# EAGLE schematic Placa_Principal_VF (EAGLE 9.7.0)
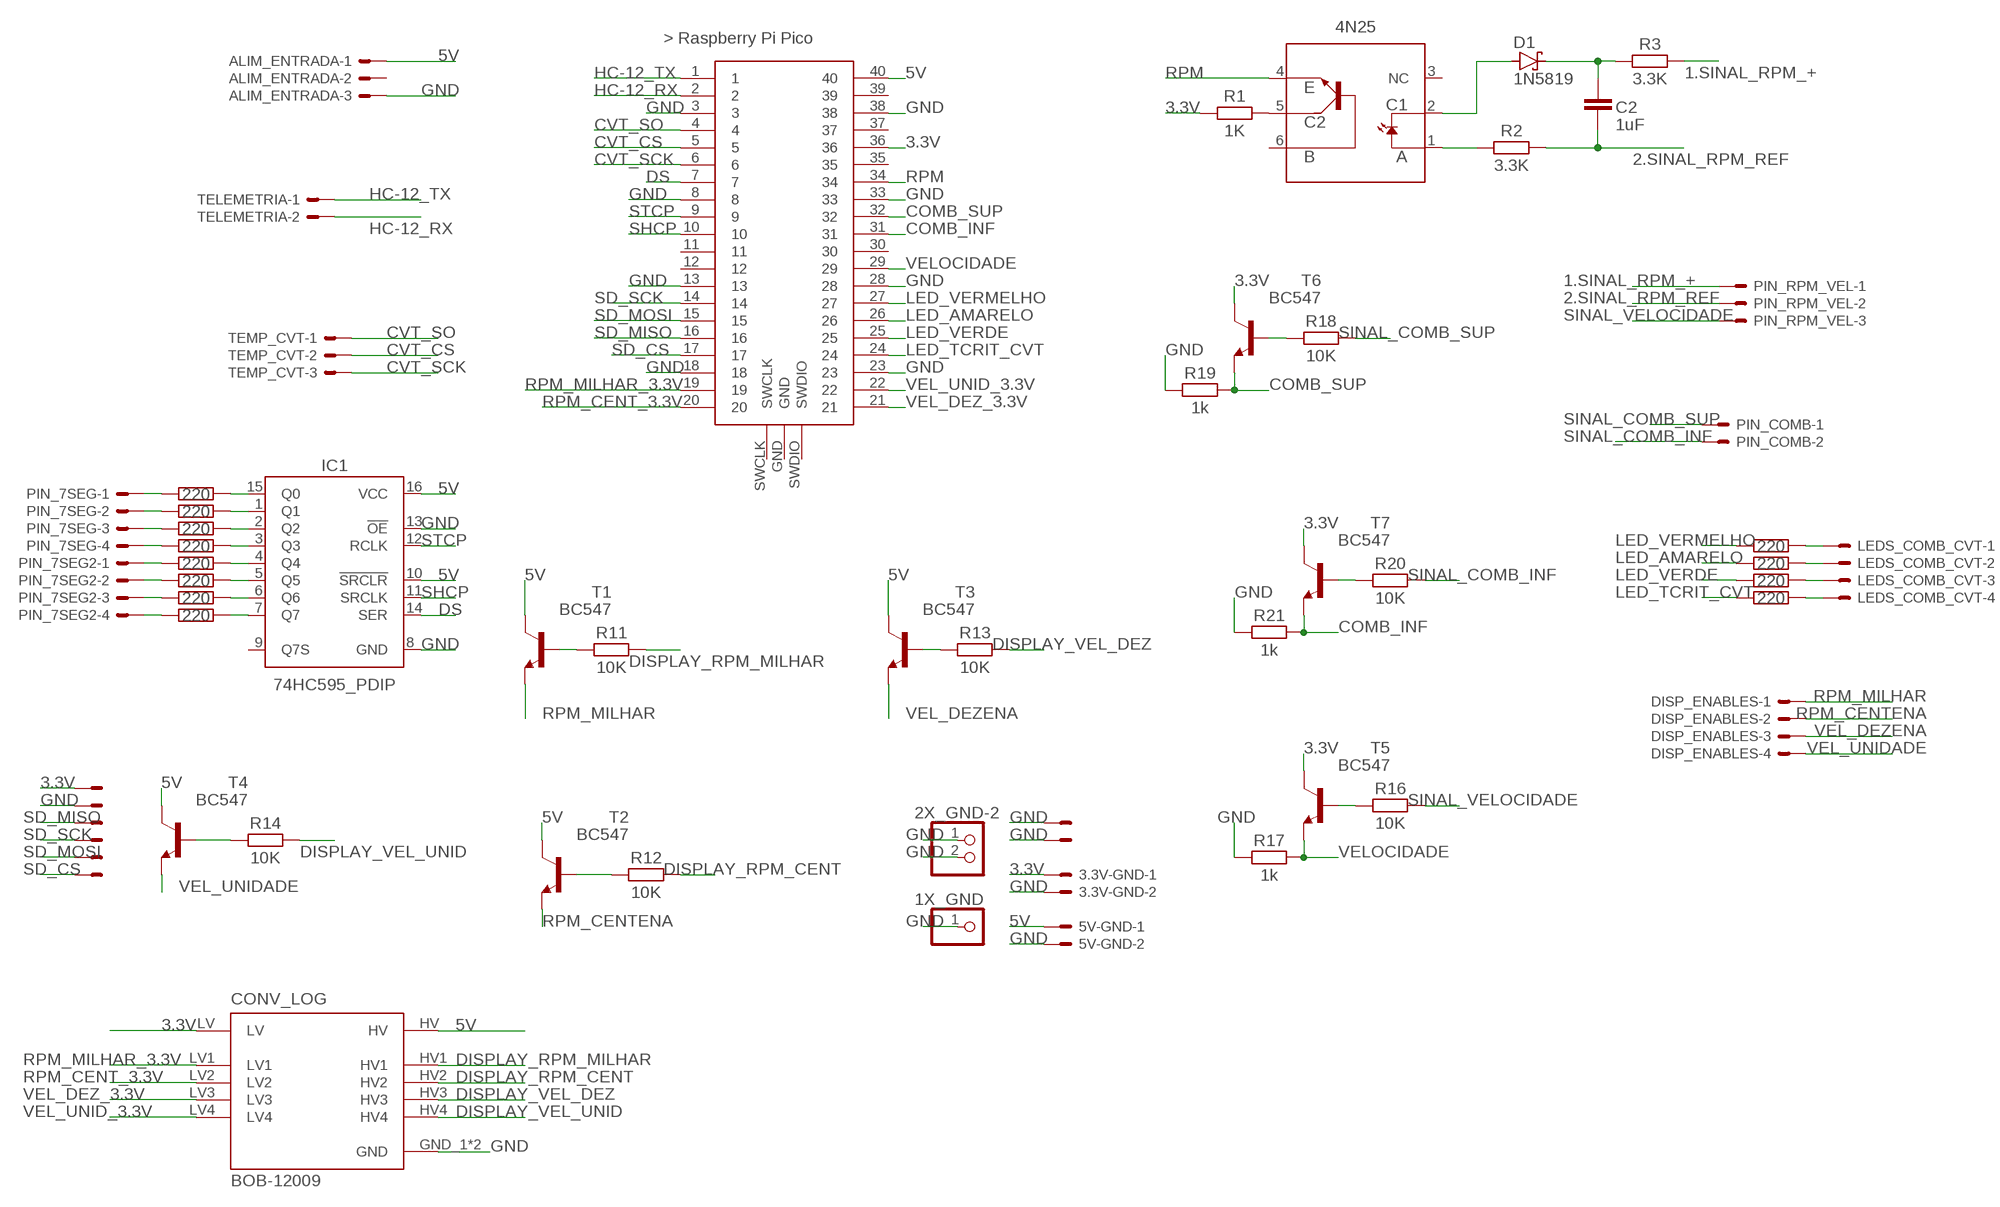
[diagram p0: schematic, sheet 1]

## Parts
1X_GND  PINHD-1X1  [1X01]
2X_GND  JST-XH-02-PIN-ROUND-PAD  [JST-XH-02-PACKAGE-ROUND-PAD]
2X_GND-2  PINHD-1X2  [1X02]
3.3V  JST-XH-02-PIN-ROUND-PAD  [JST-XH-02-PACKAGE-ROUND-PAD]
3.3V-GND  JST-XH-02-PIN-ROUND-PAD  [JST-XH-02-PACKAGE-ROUND-PAD]
4N25  4N25  [DIP762W60P254L712H480Q6B]
5V-GND  JST-XH-02-PIN-ROUND-PAD  [JST-XH-02-PACKAGE-ROUND-PAD]
ALIM_ENTRADA  JST-XH-03-PIN-ROUND-PAD  [JST-XH-03-PACKAGE-ROUND-PAD]
C2  1uF  C_RADIAL-12.5MM-DIA  [CAPRD550W60D1025H1250B]
CONV_LOG  BOB-12009  [CONV_BOB-12009]
D1  1N5819  1N5817-B  [DO41-7.6]
DISP_ENABLES  JST-XH-04-PIN-ROUND-PAD  [JST-XH-04-PACKAGE-ROUND-PAD]
IC1  74HC595_PDIP  [DIP762W53P254L1969H508Q16B]
LEDS_COMB_CVT  JST-XH-04-PIN-ROUND-PAD  [JST-XH-04-PACKAGE-ROUND-PAD]
MOD_SD  JST-XH-04-PIN-ROUND-PAD  [JST-XH-04-PACKAGE-ROUND-PAD]
PIN_7SEG  JST-XH-04-PIN-ROUND-PAD  [JST-XH-04-PACKAGE-ROUND-PAD]
PIN_7SEG2  JST-XH-04-PIN-ROUND-PAD  [JST-XH-04-PACKAGE-ROUND-PAD]
PIN_COMB  JST-XH-02-PIN-ROUND-PAD  [JST-XH-02-PACKAGE-ROUND-PAD]
PIN_RPM_VEL  JST-XH-03-PIN-ROUND-PAD  [JST-XH-03-PACKAGE-ROUND-PAD]
R1  1K  R_AXIAL-7.2MM-PITCH  [RESAD724W46L381D178B]
R2  3.3K  R_AXIAL-7.2MM-PITCH  [RESAD724W46L381D178B]
R3  3.3K  R_AXIAL-7.2MM-PITCH  [RESAD724W46L381D178B]
R4  220  R_AXIAL-7.2MM-PITCH  [RESAD724W46L381D178B]
R5  220  R_AXIAL-7.2MM-PITCH  [RESAD724W46L381D178B]
R6  220  R_AXIAL-7.2MM-PITCH  [RESAD724W46L381D178B]
R7  220  R_AXIAL-7.2MM-PITCH  [RESAD724W46L381D178B]
R8  220  R_AXIAL-7.2MM-PITCH  [RESAD724W46L381D178B]
R9  220  R_AXIAL-7.2MM-PITCH  [RESAD724W46L381D178B]
R10  220  R_AXIAL-7.2MM-PITCH  [RESAD724W46L381D178B]
R11  10K  R_AXIAL-7.2MM-PITCH  [RESAD724W46L381D178B]
R12  10K  R_AXIAL-7.2MM-PITCH  [RESAD724W46L381D178B]
R13  10K  R_AXIAL-7.2MM-PITCH  [RESAD724W46L381D178B]
R14  10K  R_AXIAL-7.2MM-PITCH  [RESAD724W46L381D178B]
R15  220  R_AXIAL-7.2MM-PITCH  [RESAD724W46L381D178B]
R16  10K  R_AXIAL-7.2MM-PITCH  [RESAD724W46L381D178B]
R17  1k  R_AXIAL-7.2MM-PITCH  [RESAD724W46L381D178B]
R18  10K  R_AXIAL-7.2MM-PITCH  [RESAD724W46L381D178B]
R19  1k  R_AXIAL-7.2MM-PITCH  [RESAD724W46L381D178B]
R20  10K  R_AXIAL-7.2MM-PITCH  [RESAD724W46L381D178B]
R21  1k  R_AXIAL-7.2MM-PITCH  [RESAD724W46L381D178B]
R22  220  R_AXIAL-7.2MM-PITCH  [RESAD724W46L381D178B]
R23  220  R_AXIAL-7.2MM-PITCH  [RESAD724W46L381D178B]
R24  220  R_AXIAL-7.2MM-PITCH  [RESAD724W46L381D178B]
R25  220  R_AXIAL-7.2MM-PITCH  [RESAD724W46L381D178B]
T1  BC547  [TO92]
T2  BC547  [TO92]
T3  BC547  [TO92]
T4  BC547  [TO92]
T5  BC547  [TO92]
T6  BC547  [TO92]
T7  BC547  [TO92]
TELEMETRIA  JST-XH-02-PIN-ROUND-PAD  [JST-XH-02-PACKAGE-ROUND-PAD]
TEMP_CVT  JST-XH-03-PIN-ROUND-PAD  [JST-XH-03-PACKAGE-ROUND-PAD]
U$2  RASPBERRY-PI-PICO_TH  [FT_RASPBERRY-PI-PICO_TH]

## Nets
1.SINAL_RPM_+: PIN_RPM_VEL.1 R3.2
2.SINAL_RPM_REF: C2.2 PIN_RPM_VEL.2 R2.2
3.3V: 3.3V-GND.1 3.3V.1 CONV_LOG.LV R1.1 T5.3(C) T6.3(C) T7.3(C) U$2.36
5V: 5V-GND.1 ALIM_ENTRADA.1 CONV_LOG.HV IC1.10(!SRCLR) IC1.16(VCC) T1.3(C) T2.3(C) T3.3(C) T4.3(C) U$2.40
COMB_INF: R21.2 T7.1(E) U$2.31
COMB_SUP: R19.2 T6.1(E) U$2.32
CVT_CS: TEMP_CVT.2 U$2.5
CVT_SCK: TEMP_CVT.3 U$2.6
CVT_SO: TEMP_CVT.1 U$2.4
DISPLAY_RPM_CENT: CONV_LOG.HV2 R12.2
DISPLAY_RPM_MILHAR: CONV_LOG.HV1 R11.2
DISPLAY_VEL_DEZ: CONV_LOG.HV3 R13.2
DISPLAY_VEL_UNID: CONV_LOG.HV4 R14.2
DS: IC1.14(SER) U$2.7
GND: 1X_GND.1 2X_GND-2.1 2X_GND-2.2 2X_GND.1 2X_GND.2 3.3V-GND.2 3.3V.2 5V-GND.2 ALIM_ENTRADA.3 CONV_LOG.GND_1(GND) CONV_LOG.GND_2(GND) IC1.8(GND) IC1.13(!OE) R17.1 R19.1 R21.1 U$2.3 U$2.8 U$2.13 U$2.18 U$2.23 U$2.28 U$2.33 U$2.38
HC-12_RX: TELEMETRIA.2 U$2.2
HC-12_TX: TELEMETRIA.1 U$2.1
LED_AMARELO: R22.1 U$2.26
LED_TCRIT_CVT: R24.1 U$2.24
LED_VERDE: R23.1 U$2.25
LED_VERMELHO: R15.1 U$2.27
N$1: 4N25.2(C1) D1.A
N$2: 4N25.1(A) R2.1
N$3: R16.1 T5.2(B)
N$4: C2.1 D1.C R3.1
N$5: R11.1 T1.2(B)
N$6: 4N25.5(C2) R1.2
N$7: IC1.15(Q0) R4.2
N$8: IC1.1(Q1) R5.2
N$9: IC1.2(Q2) R6.2
N$10: LEDS_COMB_CVT.1 R15.2
N$11: R12.1 T2.2(B)
N$12: IC1.3(Q3) R7.2
N$13: IC1.4(Q4) R8.2
N$14: R13.1 T3.2(B)
N$15: IC1.5(Q5) R9.2
N$16: R18.1 T6.2(B)
N$17: LEDS_COMB_CVT.2 R22.2
N$18: R14.1 T4.2(B)
N$19: IC1.6(Q6) R10.2
N$20: LEDS_COMB_CVT.3 R23.2
N$21: R20.1 T7.2(B)
N$22: LEDS_COMB_CVT.4 R24.2
N$23: IC1.7(Q7) R25.2
N$24: PIN_7SEG.1 R4.1
N$25: PIN_7SEG.2 R5.1
N$26: PIN_7SEG.3 R6.1
N$27: PIN_7SEG.4 R7.1
N$28: PIN_7SEG2.1 R8.1
N$29: PIN_7SEG2.2 R9.1
N$30: PIN_7SEG2.3 R10.1
N$31: PIN_7SEG2.4 R25.1
RPM: 4N25.4(E) U$2.34
RPM_CENT_3.3V: CONV_LOG.LV2 U$2.20
RPM_CENTENA: DISP_ENABLES.2 T2.1(E)
RPM_MILHAR: DISP_ENABLES.1 T1.1(E)
RPM_MILHAR_3.3V: CONV_LOG.LV1 U$2.19
SD_CS: MOD_SD.4 U$2.17
SD_MISO: MOD_SD.1 U$2.16
SD_MOSI: MOD_SD.3 U$2.15
SD_SCK: MOD_SD.2 U$2.14
SHCP: IC1.11(SRCLK) U$2.10
SINAL_COMB_INF: PIN_COMB.2 R20.2
SINAL_COMB_SUP: PIN_COMB.1 R18.2
SINAL_VELOCIDADE: PIN_RPM_VEL.3 R16.2
STCP: IC1.12(RCLK) U$2.9
VEL_DEZ_3.3V: CONV_LOG.LV3 U$2.21
VEL_DEZENA: DISP_ENABLES.3 T3.1(E)
VEL_UNID_3.3V: CONV_LOG.LV4 U$2.22
VEL_UNIDADE: DISP_ENABLES.4 T4.1(E)
VELOCIDADE: R17.2 T5.1(E) U$2.29
Unconnected: 4N25.3(NC) 4N25.6(B) ALIM_ENTRADA.2 IC1.9(Q7S) U$2.11 U$2.12 U$2.30 U$2.35 U$2.37 U$2.39 U$2.GND U$2.SWCLK U$2.SWDIO

## Library data of the parts
1X_GND = Connector:PINHD-1X1: PIN HEADER; CATEGORY: CONNECTOR; SUB-CATEGORY: PIN-HEADER
2X_GND 3.3V 3.3V-GND 5V-GND PIN_COMB TELEMETRIA = Rembrandt Electronics - JST XH Connectors v1-0:JST-XH-02-PIN: JST XH Connector 2 Pin Wire to board connector. Pitch: 2,54 mm, (0.100") Number of pins: 2 Created by Rembrandt Electronics www.rembrandtelectronics.com
2X_GND-2 = Connector:PINHD-1X2: PIN HEADER; CATEGORY: CONNECTOR; SUB-CATEGORY: PIN-HEADER
4N25 = Opto-Electronic:4N: Optocoupler, Phototransistor Output, with Base Connection Datasheet <https://www.vishay.com/docs/83725/4n25.pdf>; CATEGORY: Opto-Electronic; DESCRIPTION: Optoisolator Transistor with Base Output 5000Vrms Channel 6-DIP; MANUFACTURER: Vishay; MPN: 4N25; OPERATING_TEMP: - 55°C to + 100 °C; PART_STATUS: Active; ROHS_COMPLIANT: COMPLIANT; SERIES: 4N2x; SUB-CATEGORY: Optocoupler; THERMALLOSS: 0.150 W
ALIM_ENTRADA PIN_RPM_VEL TEMP_CVT = Rembrandt Electronics - JST XH Connectors v1-0:JST-XH-03-PIN: JST XH Connector 2 Pin Wire to board connector. Pitch: 2,54 mm, (0.100") Number of pins: 3 Created by Rembrandt Electronics www.rembrandtelectronics.com
C2 = Capacitor:C: Capacitor - Generic; CATEGORY: Capacitor
CONV_LOG = BOB-12009:BOB-12009: Logic Level Converter - Bi-Direc; MANUFACTURER: SparkFun Electronics; MAXIMUM_PACKAGE_HEIGHT: N/A; PARTREV: 01; STANDARD: Manufacturer Recommendations
D1 = diode:1N581*: 1.0A SCHOTTKY BARRIER RECTIFIER Source: http://www.diodes.com/datasheets/ds23001.pdf
DISP_ENABLES LEDS_COMB_CVT PIN_7SEG PIN_7SEG2 = Rembrandt Electronics - JST XH Connectors v1-0:JST-XH-04-PIN: JST XH Connector 2 Pin Wire to board connector. Pitch: 2,54 mm, (0.100") Number of pins: 4 Created by Rembrandt Electronics www.rembrandtelectronics.com
IC1 = IC_Logic:74HC595: 8-Bit Shift Registers Reference Datasheet <https://www.ti.com/lit/ds/symlink/sn74hc595.pdf?ts=1637559852861&ref_url=https%253A%252F%252Fwww.google.com%252F>; CATEGORY: IC_Logic; DESCRIPTION: 8-Bit Shift Registers; MANUFACTURER: Generic; MPN: Generic; SUB-CATEGORY: Shift Register; TYPE: 8-bit
MOD_SD = Rembrandt Electronics - JST XH Connectors v1-0:JST-XH-04-PIN: JST XH Connector 2 Pin Wire to board connector. Pitch: 2,54 mm, (0.100") Number of pins: 4 Created by Rembrandt Electronics www.rembrandtelectronics.com; SPICEPREFIX: X
R1-R25 = Resistor:R: Resistor Fixed - Generic; CATEGORY: Resistor; SUB-CATEGORY: Fixed
T1-T7 = transistor:BC547: NPN TRANSISTOR
U$2 = pipico:RASPBERRY-PI-PICO_TH: Raspberry Pi Pico microcontroller board for through-hole mounting.